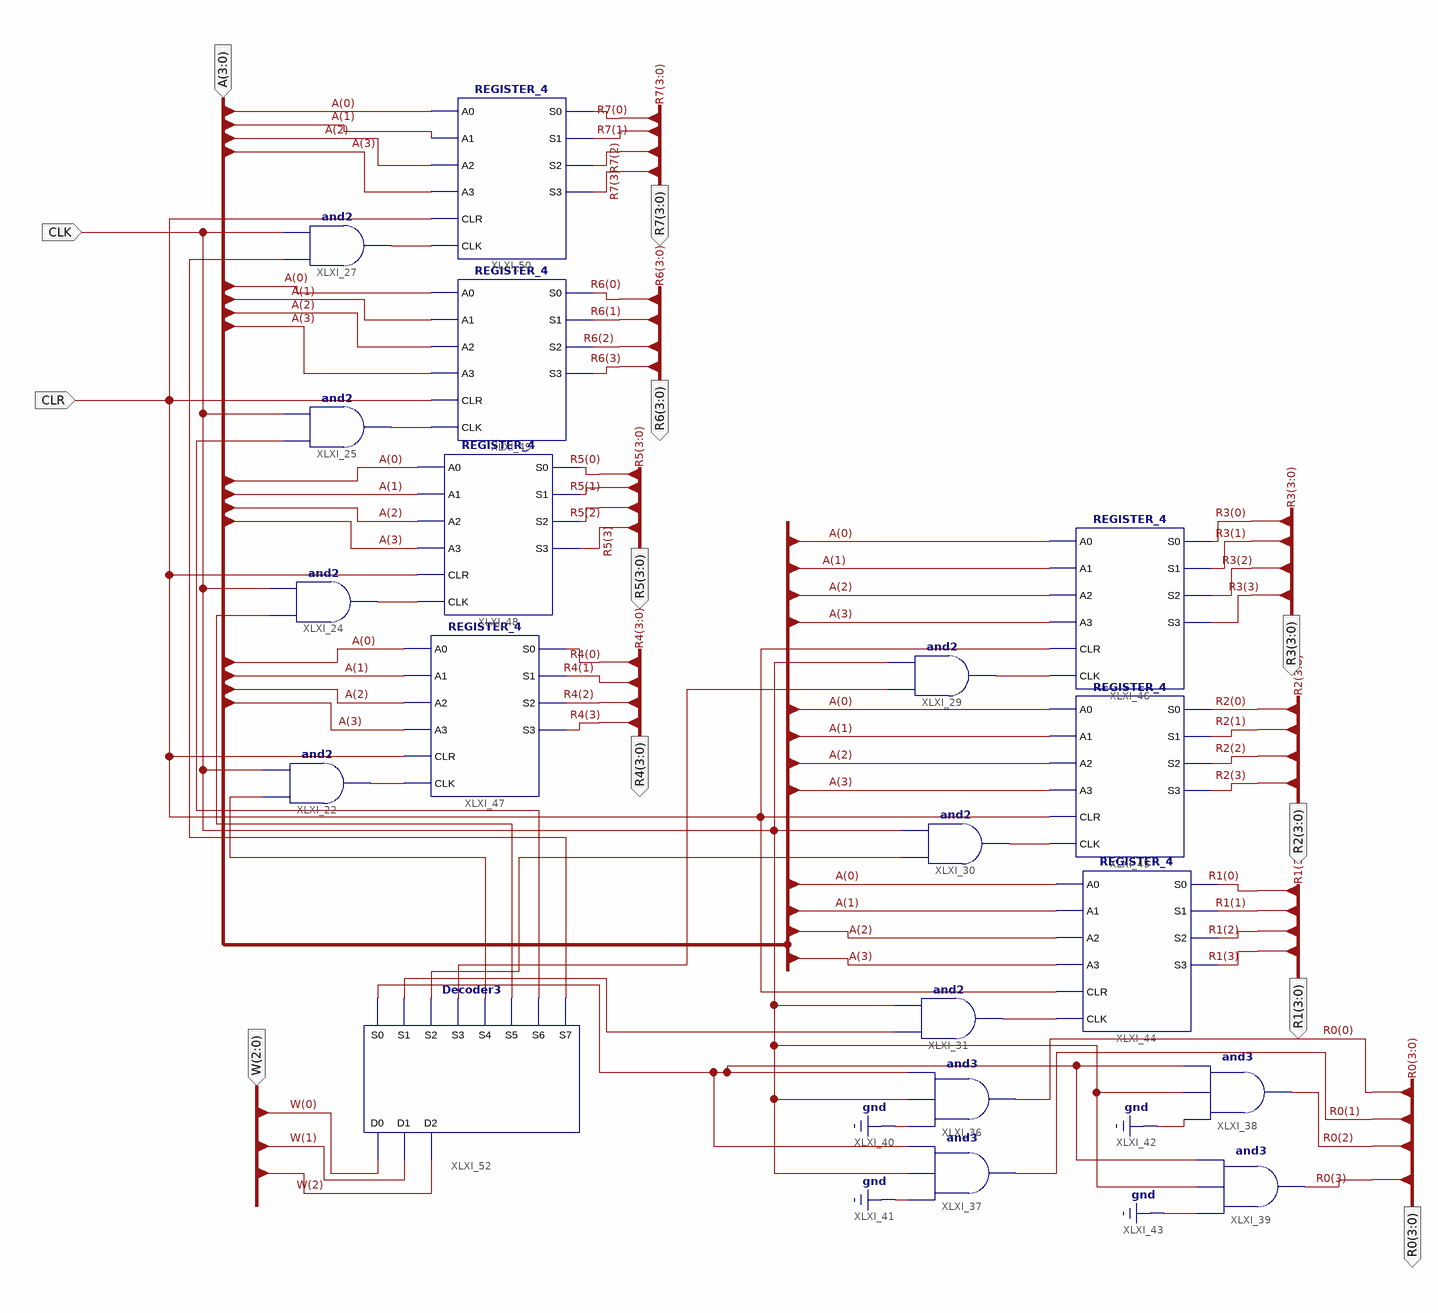
[diagram p0: schematic sheet 1]
// Xilinx ISE schematic Reg_Bank.sch (spartan3e) as structural Verilog: 19 symbols, 12 ports
module Reg_Bank (
  input  [3:0] A,
  input  CLK,
  input  [2:0] W,
  input  CLR,
  output [3:0] R7,
  output [3:0] R6,
  output [3:0] R5,
  output [3:0] R4,
  output [3:0] R3,
  output [3:0] R2,
  output [3:0] R1,
  output [3:0] R0
);

  wire XLXN_54, XLXN_55, XLXN_57, XLXN_58, XLXN_59, XLXN_61, XLXN_62, XLXN_207, XLXN_208, XLXN_209, XLXN_210,
       XLXN_211, XLXN_212, XLXN_213, XLXN_217;

  and XLXI_22 (XLXN_58, XLXN_210, CLK);
  and XLXI_24 (XLXN_57, XLXN_209, CLK);
  and XLXI_25 (XLXN_55, XLXN_208, CLK);
  and XLXI_27 (XLXN_54, XLXN_207, CLK);
  and XLXI_29 (XLXN_59, XLXN_211, CLK);
  and XLXI_30 (XLXN_61, XLXN_212, CLK);
  and XLXI_31 (XLXN_62, XLXN_213, CLK);
  and XLXI_36 (R0[0], 1'b0, CLK, XLXN_217);
  and XLXI_37 (R0[1], 1'b0, CLK, XLXN_217);
  and XLXI_38 (R0[2], 1'b0, CLK, XLXN_217);
  and XLXI_39 (R0[3], 1'b0, CLK, XLXN_217);
  REGISTER_4 XLXI_44 (
    .A0(A[0]), .A1(A[1]), .A2(A[2]), .A3(A[3]), .CLK(XLXN_62), .CLR(CLR), .S0(R1[0]), .S1(R1[1]), .S2(R1[2]),
    .S3(R1[3]));
  REGISTER_4 XLXI_45 (
    .A0(A[0]), .A1(A[1]), .A2(A[2]), .A3(A[3]), .CLK(XLXN_61), .CLR(CLR), .S0(R2[0]), .S1(R2[1]), .S2(R2[2]),
    .S3(R2[3]));
  REGISTER_4 XLXI_46 (
    .A0(A[0]), .A1(A[1]), .A2(A[2]), .A3(A[3]), .CLK(XLXN_59), .CLR(CLR), .S0(R3[0]), .S1(R3[1]), .S2(R3[2]),
    .S3(R3[3]));
  REGISTER_4 XLXI_47 (
    .A0(A[0]), .A1(A[1]), .A2(A[2]), .A3(A[3]), .CLK(XLXN_58), .CLR(CLR), .S0(R4[0]), .S1(R4[1]), .S2(R4[2]),
    .S3(R4[3]));
  REGISTER_4 XLXI_48 (
    .A0(A[0]), .A1(A[1]), .A2(A[2]), .A3(A[3]), .CLK(XLXN_57), .CLR(CLR), .S0(R5[0]), .S1(R5[1]), .S2(R5[2]),
    .S3(R5[3]));
  REGISTER_4 XLXI_49 (
    .A0(A[0]), .A1(A[1]), .A2(A[2]), .A3(A[3]), .CLK(XLXN_55), .CLR(CLR), .S0(R6[0]), .S1(R6[1]), .S2(R6[2]),
    .S3(R6[3]));
  REGISTER_4 XLXI_50 (
    .A0(A[0]), .A1(A[1]), .A2(A[2]), .A3(A[3]), .CLK(XLXN_54), .CLR(CLR), .S0(R7[0]), .S1(R7[1]), .S2(R7[2]),
    .S3(R7[3]));
  Decoder3 XLXI_52 (
    .D0(W[0]), .D1(W[1]), .D2(W[2]), .S0(XLXN_217), .S1(XLXN_213), .S2(XLXN_212), .S3(XLXN_211),
    .S4(XLXN_210), .S5(XLXN_209), .S6(XLXN_208), .S7(XLXN_207));
endmodule
